# Altium schematic sheet MainMCU.SchDoc
size A3; SheetNumber: 1; SheetTotal: 1
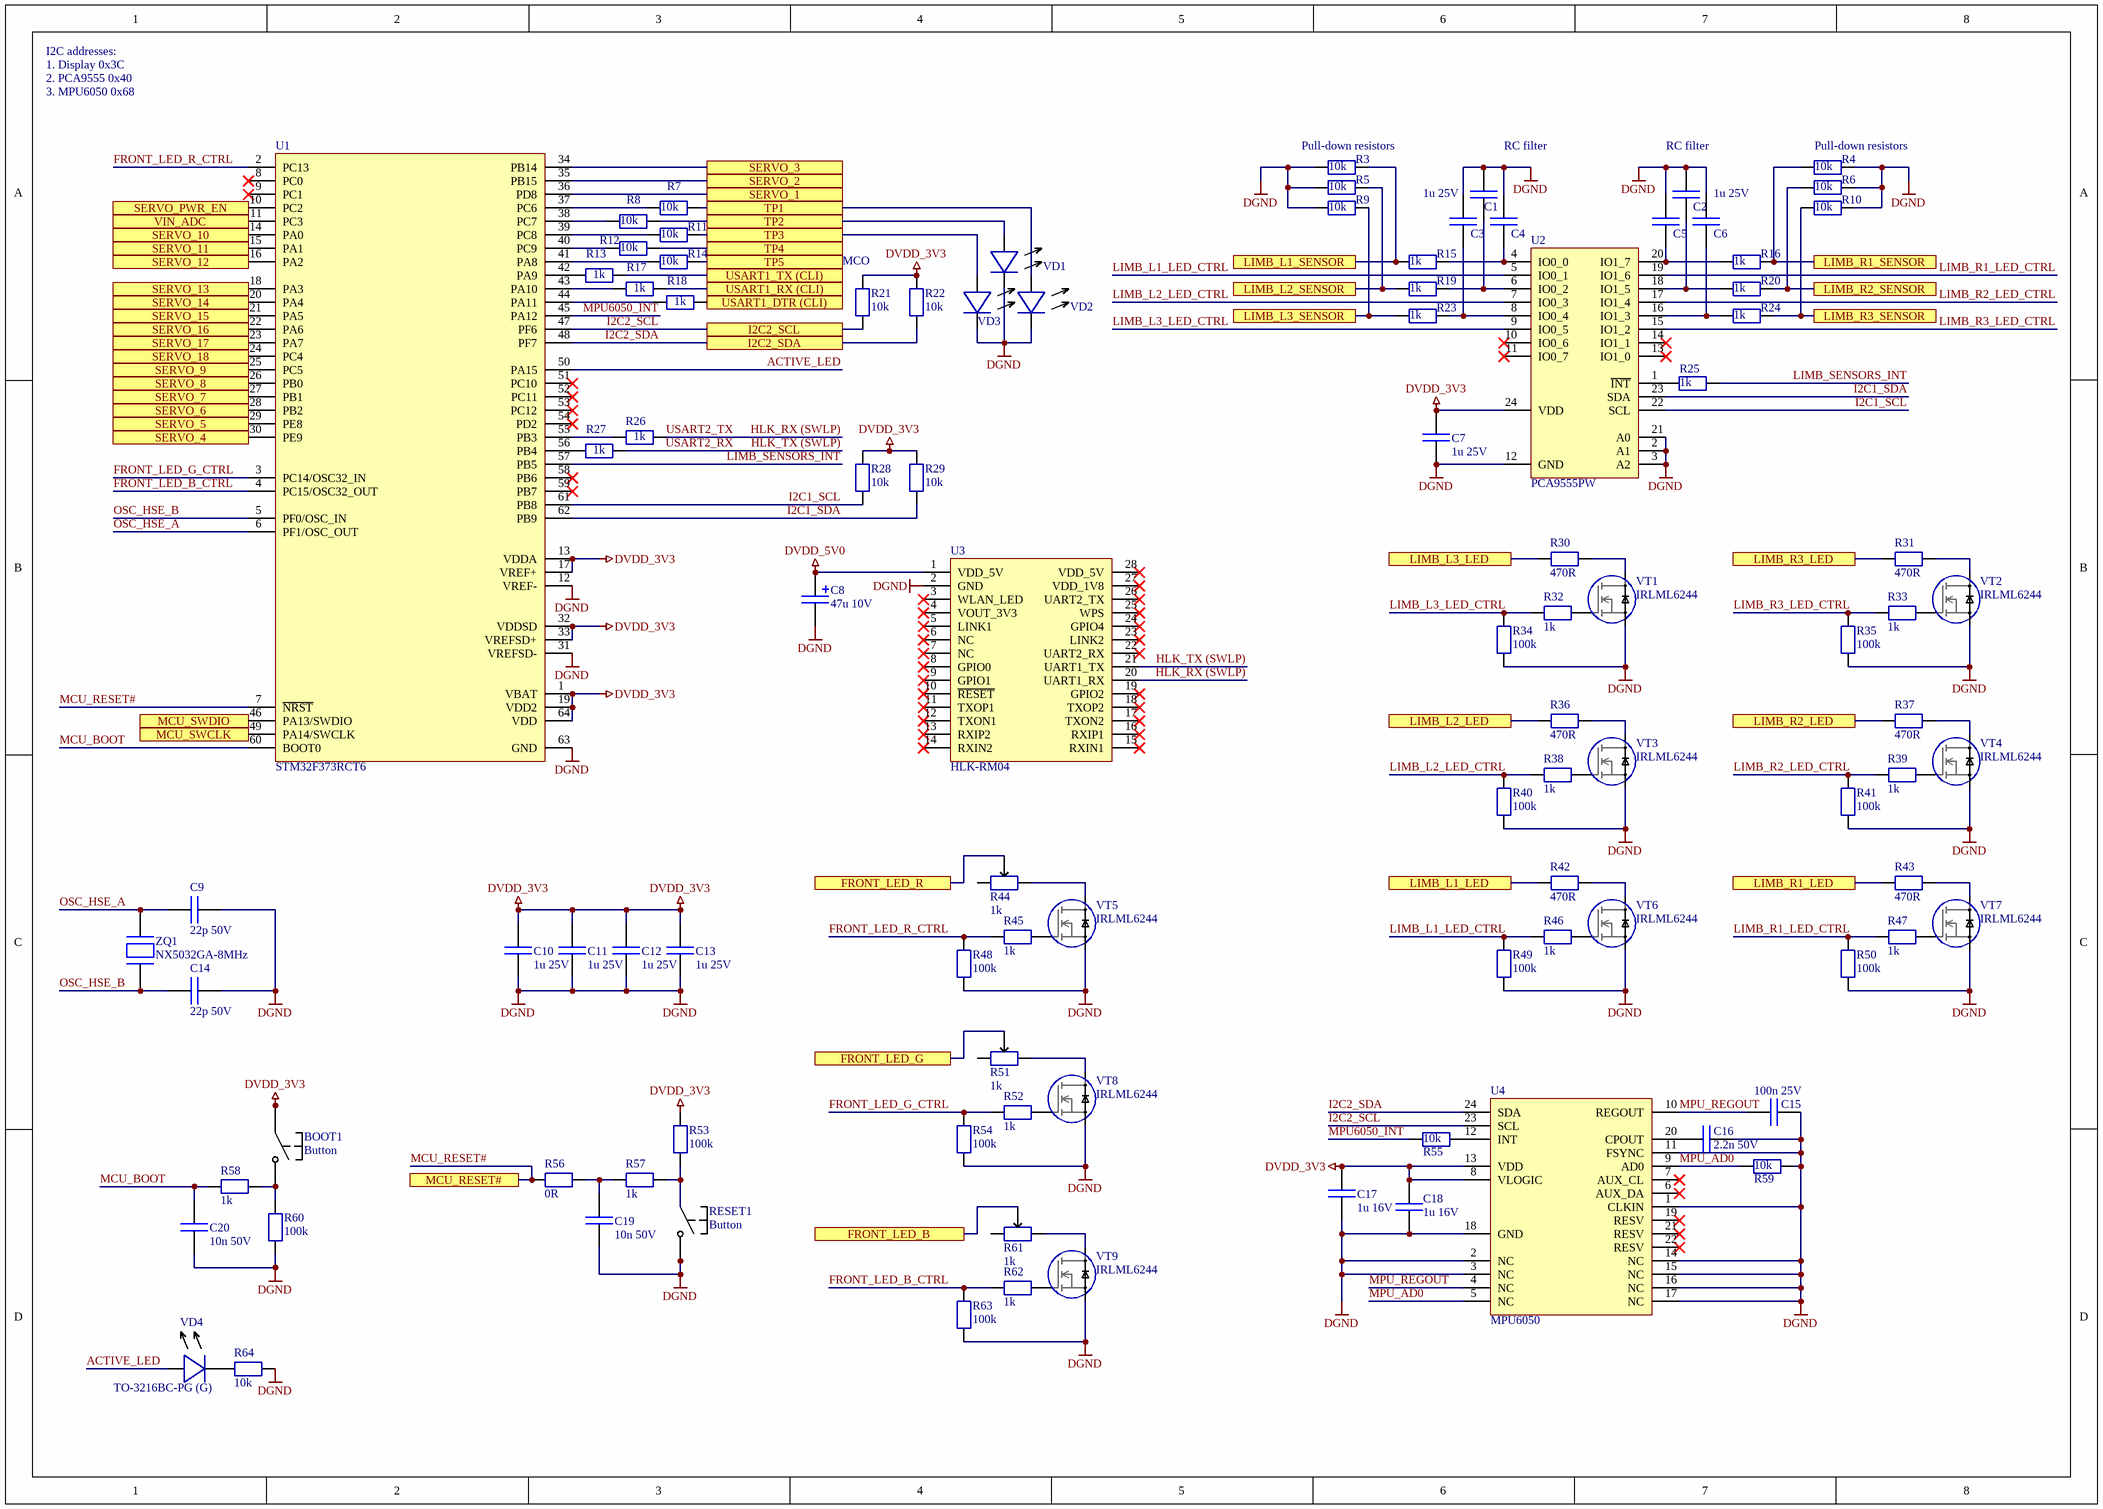
[diagram p0: MainMCU.SchDoc]

## Parts
BOOT1  Button  [BUTTON_SMD_3x6]
C1  1u 25V  [C_0603/1608]
C2  1u 25V  [C_0603/1608]
C3  1u 25V  [C_0603/1608]  (value not drawn)
C4  1u 25V  [C_0603/1608]  (value not drawn)
C5  1u 25V  [C_0603/1608]  (value not drawn)
C6  1u 25V  [C_0603/1608]  (value not drawn)
C7  1u 25V  [C_0603/1608]
C8  47u 10V  [TECAP_TYPE_B]
C9  22p 50V  [C_0603/1608]
C10  1u 25V  [C_0603/1608]
C11  1u 25V  [C_0603/1608]
C12  1u 25V  [C_0603/1608]
C13  1u 25V  [C_0603/1608]
C14  22p 50V  [C_0603/1608]
C15  100n 25V  [C_0603/1608]
C16  2.2n 50V  [C_0603/1608]
C17  1u 16V  [C_0402/1005]
C18  1u 16V  [C_0402/1005]
C19  10n 50V  [C_0603/1608]
C20  10n 50V  [C_0603/1608]
R3  10k  [R_0603/1608]
R4  10k  [R_0603/1608]
R5  10k  [R_0603/1608]
R6  10k  [R_0603/1608]
R7  10k  [R_0603/1608]
R8  10k  [R_0603/1608]
R9  10k  [R_0603/1608]
R10  10k  [R_0603/1608]
R11  10k  [R_0603/1608]
R12  10k  [R_0603/1608]
R13  1k  [R_0603/1608]
R14  10k  [R_0603/1608]
R15  1k  [R_0603/1608]
R16  1k  [R_0603/1608]
R17  1k  [R_0603/1608]
R18  1k  [R_0603/1608]
R19  1k  [R_0603/1608]
R20  1k  [R_0603/1608]
R21  10k  [R_0603/1608]
R22  10k  [R_0603/1608]
R23  1k  [R_0603/1608]
R24  1k  [R_0603/1608]
R25  1k  [R_0603/1608]
R26  1k  [R_0603/1608]
R27  1k  [R_0603/1608]
R28  10k  [R_0603/1608]
R29  10k  [R_0603/1608]
R30  470R  [R_0603/1608]
R31  470R  [R_0603/1608]
R32  1k  [R_0603/1608]
R33  1k  [R_0603/1608]
R34  100k  [R_0603/1608]
R35  100k  [R_0603/1608]
R36  470R  [R_0603/1608]
R37  470R  [R_0603/1608]
R38  1k  [R_0603/1608]
R39  1k  [R_0603/1608]
R40  100k  [R_0603/1608]
R41  100k  [R_0603/1608]
R42  470R  [R_0603/1608]
R43  470R  [R_0603/1608]
R44  1k  [R_VAR_3.2x3.2_SMD]
R45  1k  [R_0603/1608]
R46  1k  [R_0603/1608]
R47  1k  [R_0603/1608]
R48  100k  [R_0603/1608]
R49  100k  [R_0603/1608]
R50  100k  [R_0603/1608]
R51  1k  [R_VAR_3.2x3.2_SMD]
R52  1k  [R_0603/1608]
R53  100k  [R_0603/1608]
R54  100k  [R_0603/1608]
R55  10k  [R_0603/1608]
R56  0R  [R_0603/1608]
R57  1k  [R_0603/1608]
R58  1k  [R_0603/1608]
R59  10k  [R_0603/1608]
R60  100k  [R_0603/1608]
R61  1k  [R_VAR_3.2x3.2_SMD]
R62  1k  [R_0603/1608]
R63  100k  [R_0603/1608]
R64  10k  [R_0603/1608]
RESET1  Button  [BUTTON_SMD_3x6]
U1  STM32F373RCT6  [LQFP64]
U2  PCA9555PW  [SO24_0.65]
U3  HLK-RM04  [HLK-RM04]
U4  MPU6050  [MPU6050]
VD1  TO-3216BC-PG (G)  [LED_0603/1608]  (value not drawn)
VD2  TO-3216BC-PG (G)  [LED_0603/1608]  (value not drawn)
VD3  TO-3216BC-PG (G)  [LED_0603/1608]  (value not drawn)
VD4  TO-3216BC-PG (G)  [LED_0603/1608]
VT1  IRLML6244  [SOT23-3]
VT2  IRLML6244  [SOT23-3]
VT3  IRLML6244  [SOT23-3]
VT4  IRLML6244  [SOT23-3]
VT5  IRLML6244  [SOT23-3]
VT6  IRLML6244  [SOT23-3]
VT7  IRLML6244  [SOT23-3]
VT8  IRLML6244  [SOT23-3]
VT9  IRLML6244  [SOT23-3]
ZQ1  NX5032GA-8MHz  [OSC_2PINS SMD]

## Ports
FRONT_LED_B, FRONT_LED_G, FRONT_LED_R, I2C2_SCL, I2C2_SDA, LIMB_L1_LED, LIMB_L1_SENSOR, LIMB_L2_LED, LIMB_L2_SENSOR, LIMB_L3_LED, LIMB_L3_SENSOR, LIMB_R1_LED, LIMB_R1_SENSOR, LIMB_R2_LED, LIMB_R2_SENSOR, LIMB_R3_LED, LIMB_R3_SENSOR, MCU_RESET#, MCU_SWCLK, MCU_SWDIO, SERVO_1, SERVO_2, SERVO_3, SERVO_4, SERVO_5, SERVO_6, SERVO_7, SERVO_8, SERVO_9, SERVO_10, SERVO_11, SERVO_12, SERVO_13, SERVO_14, SERVO_15, SERVO_16, SERVO_17, SERVO_18, SERVO_PWR_EN, TP1, TP2, TP3, TP4, TP5, USART1_DTR (CLI), USART1_RX (CLI), USART1_TX (CLI), VIN_ADC

## Nets
DGND: C1.1 C2.1 C3.1 C4.1 C5.1 C6.1 C7.2 C8.2(NEG) C9.2 C10.2 C11.2 C12.2 C13.2 C14.2 C15.2 C16.2 C17.2 C18.2 C19.2 C20.2 R3.1 R4.1 R5.1 R6.1 R9.1 R10.1 R34.1 R35.1 R40.1 R41.1 R48.1 R49.1 R50.1 R54.1 R59.1 R60.2 R63.1 R64.1 RESET1.2 RESET1.4 U1.12(VREF-) U1.31(VREFSD-) U1.63(GND) U2.2(A1) U2.3(A2) U2.12(GND) U2.21(A0) U3.2(GND) U4.1(CLKIN) U4.2(NC) U4.3(NC) U4.11(FSYNC) U4.14(NC) U4.15(NC) U4.16(NC) U4.17(NC) U4.18(GND) VD1.C VD2.C VD3.C VT1.S VT2.S VT3.S VT4.S VT5.S VT6.S VT7.S VT8.S VT9.S
DVDD_3V3: BOOT1.1 BOOT1.3 C7.1 C10.1 C11.1 C12.1 C13.1 C17.1 C18.1 R21.2 R22.2 R28.2 R29.2 R53.1 U1.1(VBAT) U1.13(VDDA) U1.17(VREF+) U1.19(VDD2) U1.32(VDDSD) U1.33(VREFSD+) U1.64(VDD) U2.24(VDD) U4.8(VLOGIC) U4.13(VDD)
DVDD_5V0: C8.1(POS) U3.1(VDD_5V)
ACTIVE_LED: U1.50(PA15) VD4.A
FRONT_LED_B: R61.2 ; port FRONT_LED_B
FRONT_LED_B_CTRL: R62.2 R63.2 U1.4(PC15/OSC32_OUT)
FRONT_LED_G: R51.2 ; port FRONT_LED_G
FRONT_LED_G_CTRL: R52.2 R54.2 U1.3(PC14/OSC32_IN)
FRONT_LED_R: R44.2 ; port FRONT_LED_R
FRONT_LED_R_CTRL: R45.2 R48.2 U1.2(PC13)
HLK_RX (SWLP): R26.1 U3.20(UART1_RX)  [also labelled USART2_TX]
HLK_TX (SWLP): R27.1 U3.21(UART1_TX)  [also labelled USART2_RX]
I2C1_SCL: R28.1 U1.61(PB8) U2.22(SCL)
I2C1_SDA: R29.1 U1.62(PB9) U2.23(SDA)
I2C2_SCL: R21.1 U1.47(PF6) U4.23(SCL) ; port I2C2_SCL
I2C2_SDA: R22.1 U1.48(PF7) U4.24(SDA) ; port I2C2_SDA
LIMB_L1_LED: R42.2 ; port LIMB_L1_LED
LIMB_L1_LED_CTRL: R46.2 R49.2 U2.5(IO0_1)
LIMB_L1_SENSOR: R3.2 R15.1 ; port LIMB_L1_SENSOR
LIMB_L2_LED: R36.2 ; port LIMB_L2_LED
LIMB_L2_LED_CTRL: R38.2 R40.2 U2.7(IO0_3)
LIMB_L2_SENSOR: R5.2 R19.1 ; port LIMB_L2_SENSOR
LIMB_L3_LED: R30.2 ; port LIMB_L3_LED
LIMB_L3_LED_CTRL: R32.2 R34.2 U2.9(IO0_5)
LIMB_L3_SENSOR: R9.2 R23.1 ; port LIMB_L3_SENSOR
LIMB_R1_LED: R43.2 ; port LIMB_R1_LED
LIMB_R1_LED_CTRL: R47.2 R50.2 U2.19(IO1_6)
LIMB_R1_SENSOR: R4.2 R16.2 ; port LIMB_R1_SENSOR
LIMB_R2_LED: R37.2 ; port LIMB_R2_LED
LIMB_R2_LED_CTRL: R39.2 R41.2 U2.17(IO1_4)
LIMB_R2_SENSOR: R6.2 R20.2 ; port LIMB_R2_SENSOR
LIMB_R3_LED: R31.2 ; port LIMB_R3_LED
LIMB_R3_LED_CTRL: R33.2 R35.2 U2.15(IO1_2)
LIMB_R3_SENSOR: R10.2 R24.2 ; port LIMB_R3_SENSOR
LIMB_SENSORS_INT: R25.2 U1.57(PB5)
MCU_BOOT: C20.1 R58.2 U1.60(BOOT0)
MCU_RESET#: R56.2 U1.7(~{NRST}) ; port MCU_RESET#
MCU_SWCLK: U1.49(PA14/SWCLK) ; port MCU_SWCLK
MCU_SWDIO: U1.46(PA13/SWDIO) ; port MCU_SWDIO
MPU6050_INT: R55.2 U1.45(PA12)
MPU_AD0: R59.2 U4.5(NC) U4.9(AD0)
MPU_REGOUT: C15.1 U4.4(NC) U4.10(REGOUT)
OSC_HSE_A: C9.1 U1.6(PF1/OSC_OUT) ZQ1.2
OSC_HSE_B: C14.1 U1.5(PF0/OSC_IN) ZQ1.1
SERVO_1: U1.36(PD8) ; port SERVO_1
SERVO_2: U1.35(PB15) ; port SERVO_2
SERVO_3: U1.34(PB14) ; port SERVO_3
SERVO_4: U1.30(PE9) ; port SERVO_4
SERVO_5: U1.29(PE8) ; port SERVO_5
SERVO_6: U1.28(PB2) ; port SERVO_6
SERVO_7: U1.27(PB1) ; port SERVO_7
SERVO_8: U1.26(PB0) ; port SERVO_8
SERVO_9: U1.25(PC5) ; port SERVO_9
SERVO_10: U1.14(PA0) ; port SERVO_10
SERVO_11: U1.15(PA1) ; port SERVO_11
SERVO_12: U1.16(PA2) ; port SERVO_12
SERVO_13: U1.18(PA3) ; port SERVO_13
SERVO_14: U1.20(PA4) ; port SERVO_14
SERVO_15: U1.21(PA5) ; port SERVO_15
SERVO_16: U1.22(PA6) ; port SERVO_16
SERVO_17: U1.23(PA7) ; port SERVO_17
SERVO_18: U1.24(PC4) ; port SERVO_18
SERVO_PWR_EN: U1.10(PC2) ; port SERVO_PWR_EN
TP1: R7.2 VD2.A ; port TP1
TP2: R8.2 VD1.A ; port TP2
TP3: R11.2 VD3.A ; port TP3
TP4: R12.2 ; port TP4
TP5: R14.2 ; port TP5
USART1_DTR (CLI): R18.1 ; port USART1_DTR (CLI)
USART1_RX (CLI): R17.1 ; port USART1_RX (CLI)
USART1_TX (CLI): R13.1 ; port USART1_TX (CLI)
VIN_ADC: U1.11(PC3) ; port VIN_ADC
NetBOOT1_2: BOOT1.2 BOOT1.4 R58.1 R60.1
NetC1_2: C1.2 R19.2 U2.6(IO0_2)
NetC2_2: C2.2 R20.1 U2.18(IO1_5)
NetC3_2: C3.2 R23.2 U2.8(IO0_4)
NetC4_2: C4.2 R15.2 U2.4(IO0_0)
NetC5_2: C5.2 R16.1 U2.20(IO1_7)
NetC6_2: C6.2 R24.1 U2.16(IO1_3)
NetC16_1: C16.1 U4.20(CPOUT)
NetC19_1: C19.1 R56.1 R57.2
NetR7_1: R7.1 U1.37(PC6)
NetR8_1: R8.1 U1.38(PC7)
NetR11_1: R11.1 U1.39(PC8)
NetR12_1: R12.1 U1.40(PC9)
NetR13_2: R13.2 U1.42(PA9)
NetR14_1: R14.1 U1.41(PA8)
NetR17_2: R17.2 U1.43(PA10)
NetR18_2: R18.2 U1.44(PA11)
NetR25_1: R25.1 U2.1(~{INT})
NetR26_2: R26.2 U1.55(PB3)
NetR27_2: R27.2 U1.56(PB4)
NetR30_1: R30.1 VT1.D
NetR31_1: R31.1 VT2.D
NetR32_1: R32.1 VT1.G
NetR33_1: R33.1 VT2.G
NetR36_1: R36.1 VT3.D
NetR37_1: R37.1 VT4.D
NetR38_1: R38.1 VT3.G
NetR39_1: R39.1 VT4.G
NetR42_1: R42.1 VT6.D
NetR43_1: R43.1 VT7.D
NetR44_3: R44.3 VT5.D
NetR45_1: R45.1 VT5.G
NetR46_1: R46.1 VT6.G
NetR47_1: R47.1 VT7.G
NetR51_3: R51.3 VT8.D
NetR52_1: R52.1 VT8.G
NetR53_2: R53.2 R57.1 RESET1.1 RESET1.3
NetR55_1: R55.1 U4.12(INT)
NetR61_3: R61.3 VT9.D
NetR62_1: R62.1 VT9.G
NetR64_2: R64.2 VD4.C

Not connected (* = marked no-connect by the designer): R44 1; R51 1; R61 1; U1 0(EP) 8(PC0)* 9(PC1)* 51(PC10)* 52(PC11)* 53(PC12)* 54(PD2)* 58(PB6)* 59(PB7)*; U2 10(IO0_6)* 11(IO0_7)* 13(IO1_0)* 14(IO1_1)*; U3 0(EP) 3(WLAN_LED)* 4(VOUT_3V3)* 5(LINK1)* 6(NC)* 7(NC)* 8(GPIO0)* 9(GPIO1)* 10(~{RESET})* 11(TXOP1)* 12(TXON1)* 13(RXIP2)* 14(RXIN2)* 15(RXIN1)* 16(RXIP1)* 17(TXON2)* 18(TXOP2)* 19(GPIO2)* 22(UART2_RX)* 23(LINK2)* 24(GPIO4)* 25(WPS)* 26(UART2_TX)* 27(VDD_1V8)* 28(VDD_5V)*; U4 0(EP) 6(AUX_DA)* 7(AUX_CL)* 19(RESV)* 21(RESV)* 22(RESV)*

## Notes on the sheet
- I2C addresses:
- 1. Display 0x3C
- 2. PCA9555 0x40
- 3. MPU6050 0x68
- (near R3) Pull-down resistors
- (near C1) RC filter
- (near C2) RC filter
- (near R4) Pull-down resistors
- (near R21) MCO

## Library data of the parts
BOOT1 RESET1 = Button: pin to pad: 3>1 4>2
C1-C7 C9-C20 = Capacitor: Non-polarized capacitor
C8 = Capacitor polar: Polarized capacitor
R3-R43 R45-R50 R52-R60 R62-R64 = Resistor
R44 R51 R61 = Resistor variable
U1 = STM32F373R: 32-bit Cortex-M3
U2 = PCA9555PW: 16 bits of General Purpose parallel / Input/Output (GPIO) expansion using I2C
U3 = HLK-RM04: WIFI-UART bridge
VD1-VD4 = LED
VT1-VT9 = MOSFET N: pin to pad: D>3 G>1 S>2
ZQ1 = Crystal oscillator